# EAGLE design fan-shield (EAGLE 6.4)
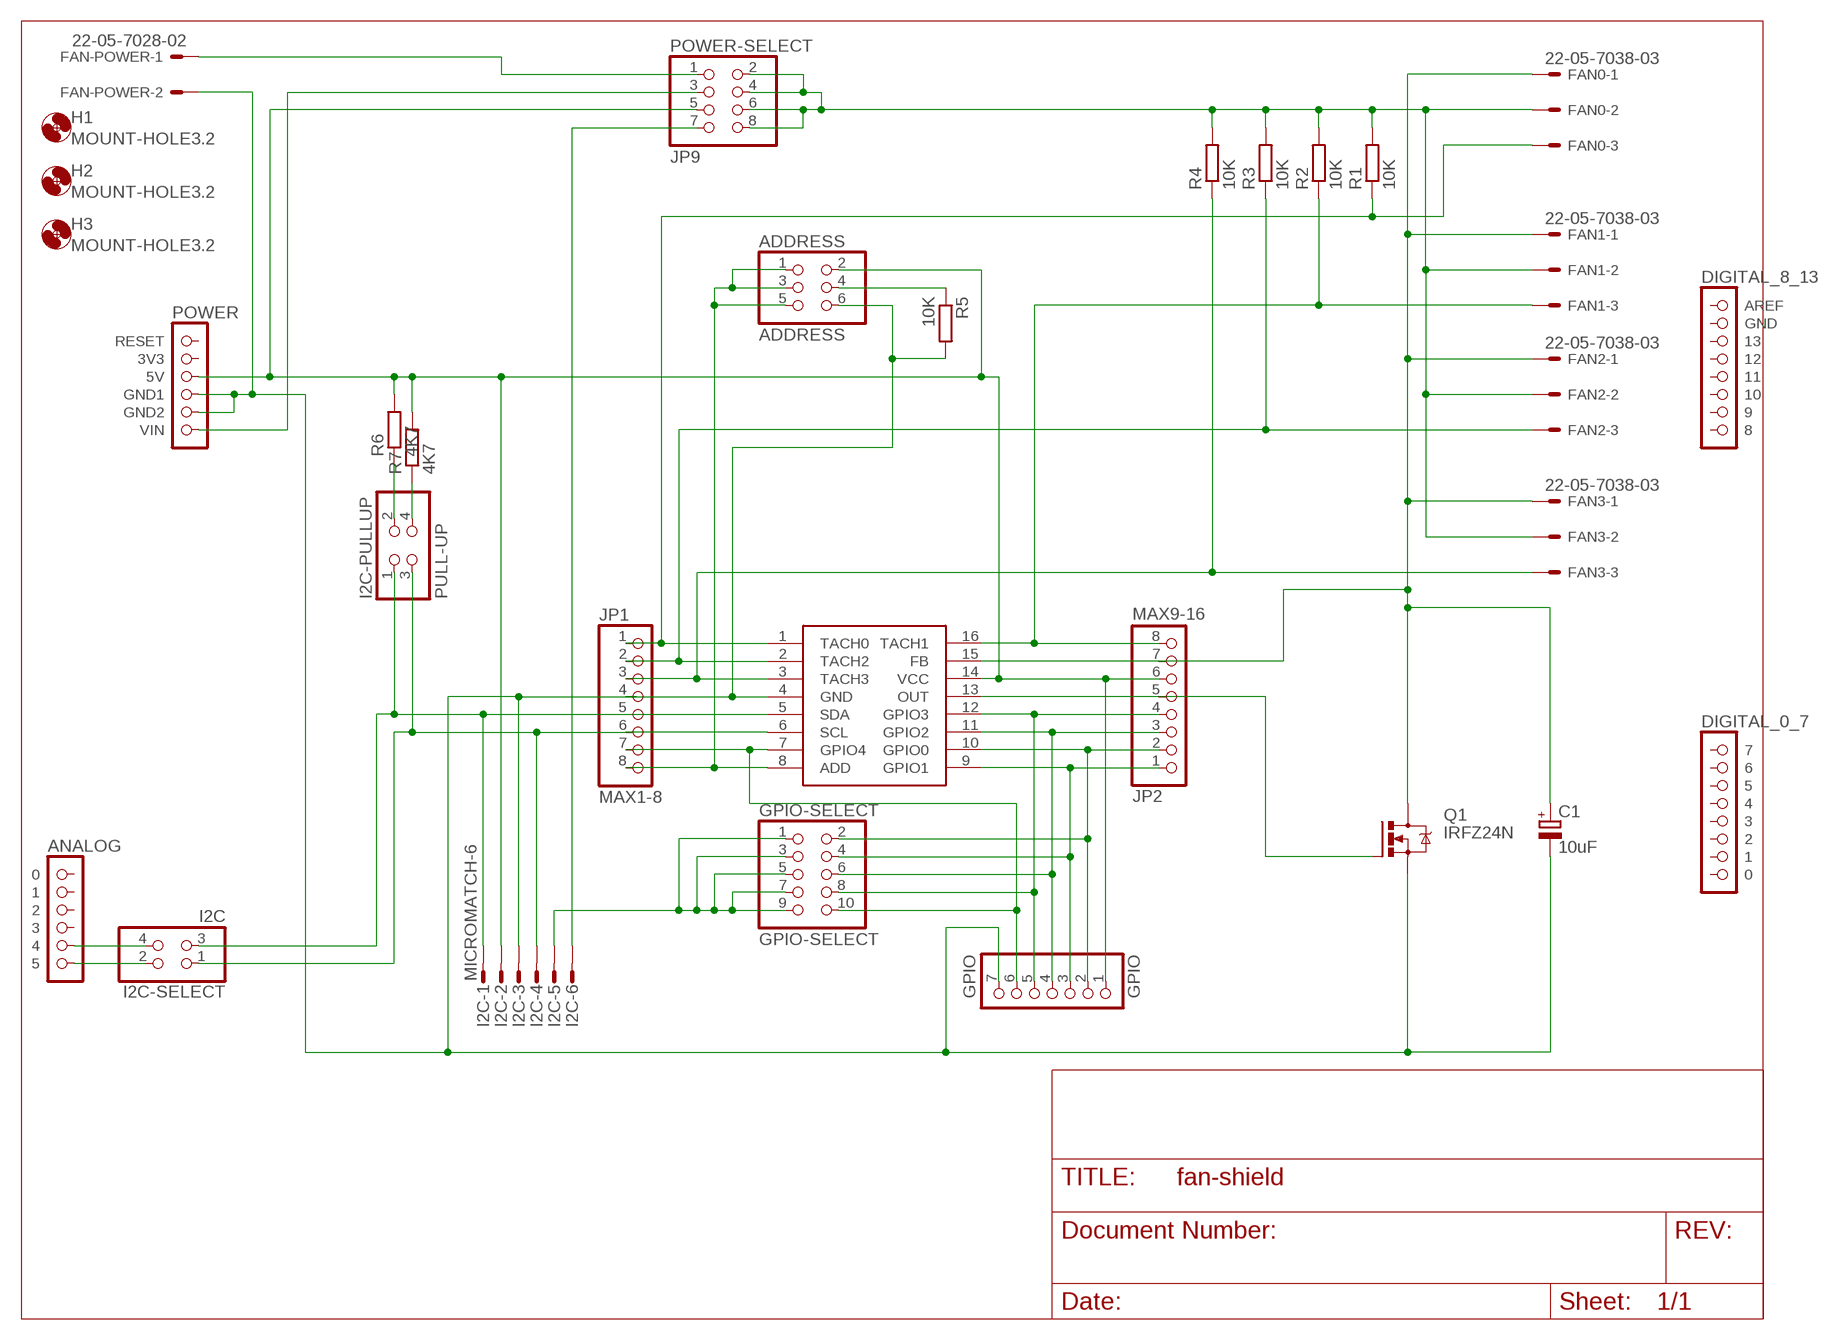
[diagram p0: schematic, sheet 1]

## Parts
ADDRESS  ADDRESS  PINHD-2X3  [2X03]
C1  10uF  CPOL-EUE2.5-6  [E2,5-6]
FAN0  22-05-7038-03  [7395-03]
FAN1  22-05-7038-03  [7395-03]
FAN2  22-05-7038-03  [7395-03]
FAN3  22-05-7038-03  [7395-03]
FAN-POWER  22-05-7028-02  [7395-02]
GPIO  GPIO  PINHD-1X7/90  [1X07/90]
GPIO-SELECT  GPIO-SELECT  PINHD-2X5  [2X05]
H1  MOUNT-HOLE3.2  [3,2]
H2  MOUNT-HOLE3.2  [3,2]
H3  MOUNT-HOLE3.2  [3,2]
I2C  MICROMATCH-6  [MICROMATCH-6]
I2C-PULLUP  PULL-UP  PINHD-2X2  [2X02]
I2C-SELECT  I2C  PINHD-2X2/90  [2X02/90]
JP1  MAX1-8  PINHD-1X8  [1X08]
JP2  MAX9-16  PINHD-1X8  [1X08]
MAX6651  MAX6651  [QSOP16]
POWER-SELECT  JP9  PINHD-2X4  [2X04]
Q1  IRFZ24N  [TO200AB]
R1  10K  R-EU_0207/10  [0207/10]
R2  10K  R-EU_0207/10  [0207/10]
R3  10K  R-EU_0207/10  [0207/10]
R4  10K  R-EU_0207/10  [0207/10]
R5  10K  R-EU_0207/10  [0207/10]
R6  4K7  R-EU_0207/10  [0207/10]
R7  4K7  R-EU_0207/10  [0207/10]
U$1  POWER  [1X06]
U$2  ANALOG  [1X06]
U$3  DIGITAL_0_7  [1X08]
U$4  DIGITAL_8_13  [1X08]

## Nets
5V: ADDRESS.2 GPIO.1 I2C.2 JP2.6 MAX6651.14(VCC) POWER-SELECT.5 R6.2 R7.2 U$1.3(5V)
ADD: ADDRESS.1 ADDRESS.3 ADDRESS.5 JP1.8 MAX6651.8(ADD)
FEEDBACK: C1.+ FAN0.1 FAN1.1 FAN2.1 FAN3.1 JP2.7 MAX6651.15(FB) Q1.D
GND: ADDRESS.6 C1.- FAN-POWER.2 GPIO.7 I2C.3 JP1.4 MAX6651.4(GND) Q1.S R5.2 U$1.4(GND1) U$1.5(GND2)
GPIO0: GPIO-SELECT.2 GPIO.2 JP2.2 MAX6651.10(GPIO0)
GPIO1: GPIO-SELECT.4 GPIO.3 JP2.1 MAX6651.9(GPIO1)
GPIO2: GPIO-SELECT.6 GPIO.4 JP2.3 MAX6651.11(GPIO2)
GPIO3: GPIO-SELECT.8 GPIO.5 JP2.4 MAX6651.12(GPIO3)
GPIO4: GPIO-SELECT.10 GPIO.6 JP1.7 MAX6651.7(GPIO4)
GPIO-CONNECT: GPIO-SELECT.1 GPIO-SELECT.3 GPIO-SELECT.5 GPIO-SELECT.7 GPIO-SELECT.9 I2C.5
I2C: I2C-SELECT.4 U$2.5
N$2: I2C-PULLUP.2 R6.1
N$3: I2C-PULLUP.4 R7.1
N$4: ADDRESS.4 R5.1
N$5: FAN-POWER.1 POWER-SELECT.1
OUT: JP2.5 MAX6651.13(OUT) Q1.G
SCL: I2C-PULLUP.3 I2C-SELECT.1 I2C.4 JP1.6 MAX6651.6(SCL)
SCL-ARDUINO: I2C-SELECT.2 U$2.6
SDA: I2C-PULLUP.1 I2C-SELECT.3 I2C.1 JP1.5 MAX6651.5(SDA)
TACH0: FAN0.3 JP1.1 MAX6651.1(TACH0) R1.1
TACH1: FAN1.3 JP2.8 MAX6651.16(TACH1) R2.1
TACH2: FAN2.3 JP1.2 MAX6651.2(TACH2) R3.1
TACH3: FAN3.3 JP1.3 MAX6651.3(TACH3) R4.1
VAUX: I2C.6 POWER-SELECT.7
VFAN: FAN0.2 FAN1.2 FAN2.2 FAN3.2 POWER-SELECT.2 POWER-SELECT.4 POWER-SELECT.6 POWER-SELECT.8 R1.2 R2.2 R3.2 R4.2
VIN: POWER-SELECT.3 U$1.6(VIN)
Unconnected: U$1.1(RESET) U$1.2(3V3) U$2.1 U$2.2 U$2.3 U$2.4 U$3.1 U$3.2 U$3.3 U$3.4 U$3.5 U$3.6 U$3.7 U$3.8 U$4.1(AREF) U$4.2(GND) U$4.3 U$4.4 U$4.5 U$4.6 U$4.7 U$4.8

## Library data of the parts
ADDRESS = pinhead:PINHD-2X3: PIN HEADER
C1 = resistor:CPOL-EU: POLARIZED CAPACITOR, European symbol
FAN0 FAN1-FAN3 = con-molex:22-?-03: CONNECTOR wire to board 2.54 mm (.1 inch) pitch header; OC_FARNELL: unknown; OC_NEWARK: unknown
FAN-POWER = con-molex:22-?-02: CONNECTOR wire to board 2.54 mm (.1 inch) pitch header; OC_FARNELL: 9731601; OC_NEWARK: unknown
GPIO = pinhead:PINHD-1X7: PIN HEADER
GPIO-SELECT = pinhead:PINHD-2X5: PIN HEADER
H1-H3 = holes:MOUNT-HOLE: MOUNTING HOLE with drill center marker
I2C = con-amp-micromatch:MICROMATCH-6: MicroMaTch 6 7-215464-6 / 0-215464-6 Drawing Number C-215464 DDEController.pdf; MPN: 7-215464-6; OC_FARNELL: 3784630; OC_NEWARK: 19R8125
I2C-PULLUP I2C-SELECT = pinhead:PINHD-2X2: PIN HEADER
JP1 JP2 = pinhead:PINHD-1X8: PIN HEADER
MAX6651 = rjs-maxim-fan-regulators:MAX6651
POWER-SELECT = pinhead:PINHD-2X4: PIN HEADER
Q1 = rjs-transistor-power:IRFZ24N: HEXFET power MOSFET
R1-R7 = resistor:R-EU_: RESISTOR, European symbol
U$1 = arduino:POWER
U$2 = arduino:ANALOG
U$3 = arduino:DIGITAL_0_7
U$4 = arduino:DIGITAL_8_13

## Board
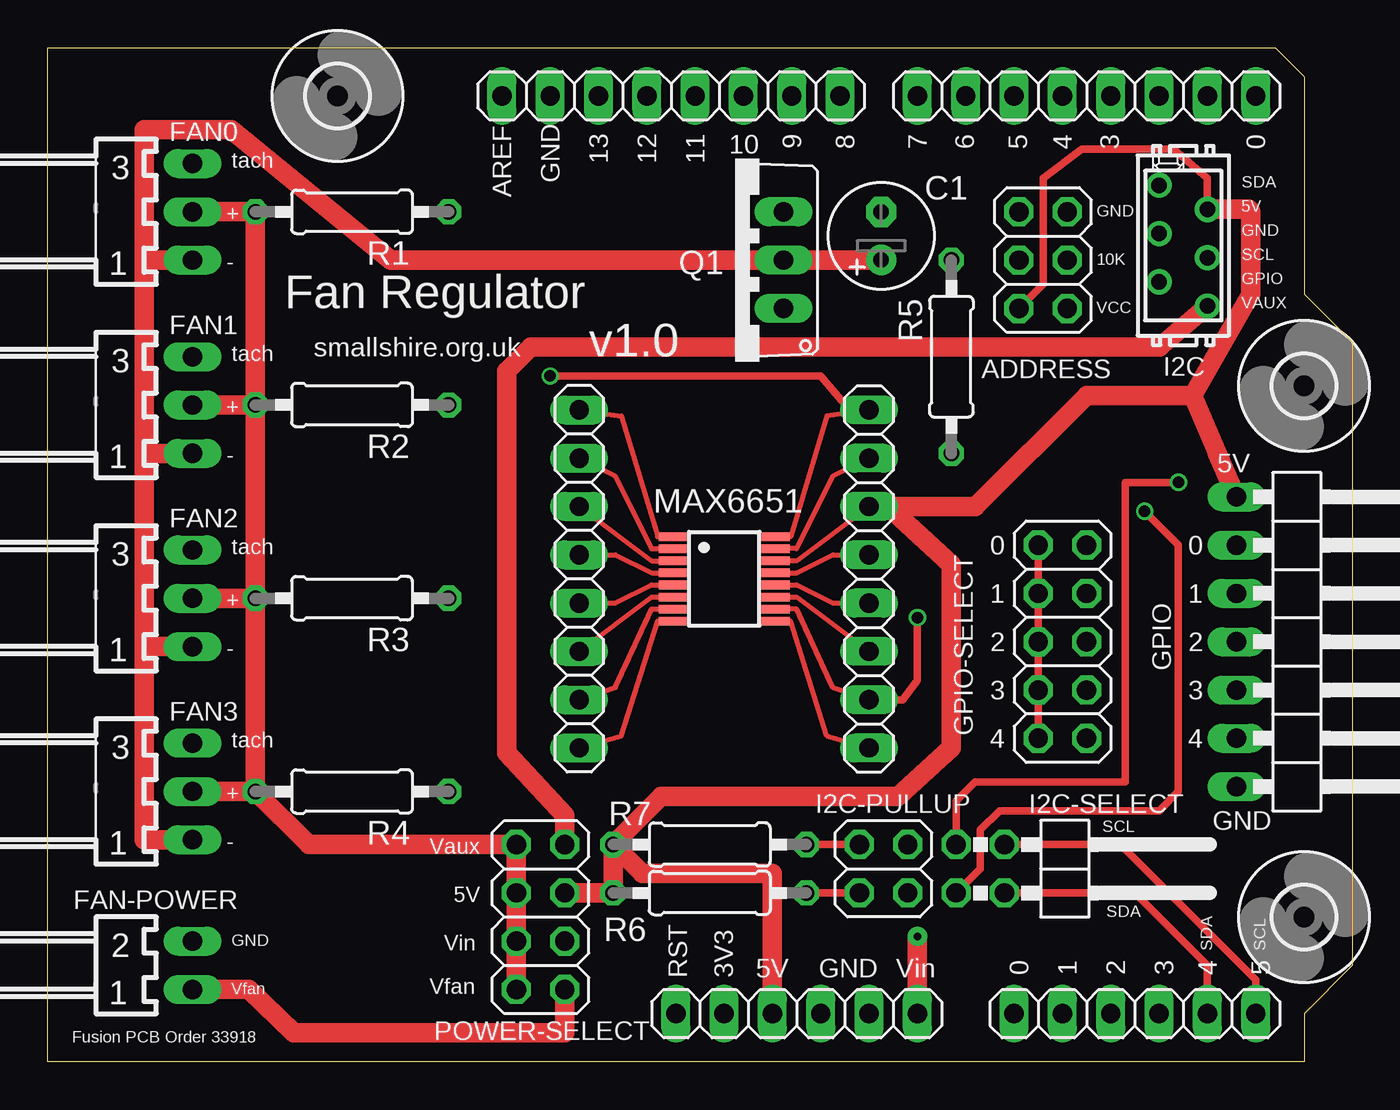
[diagram p1: board, top side]
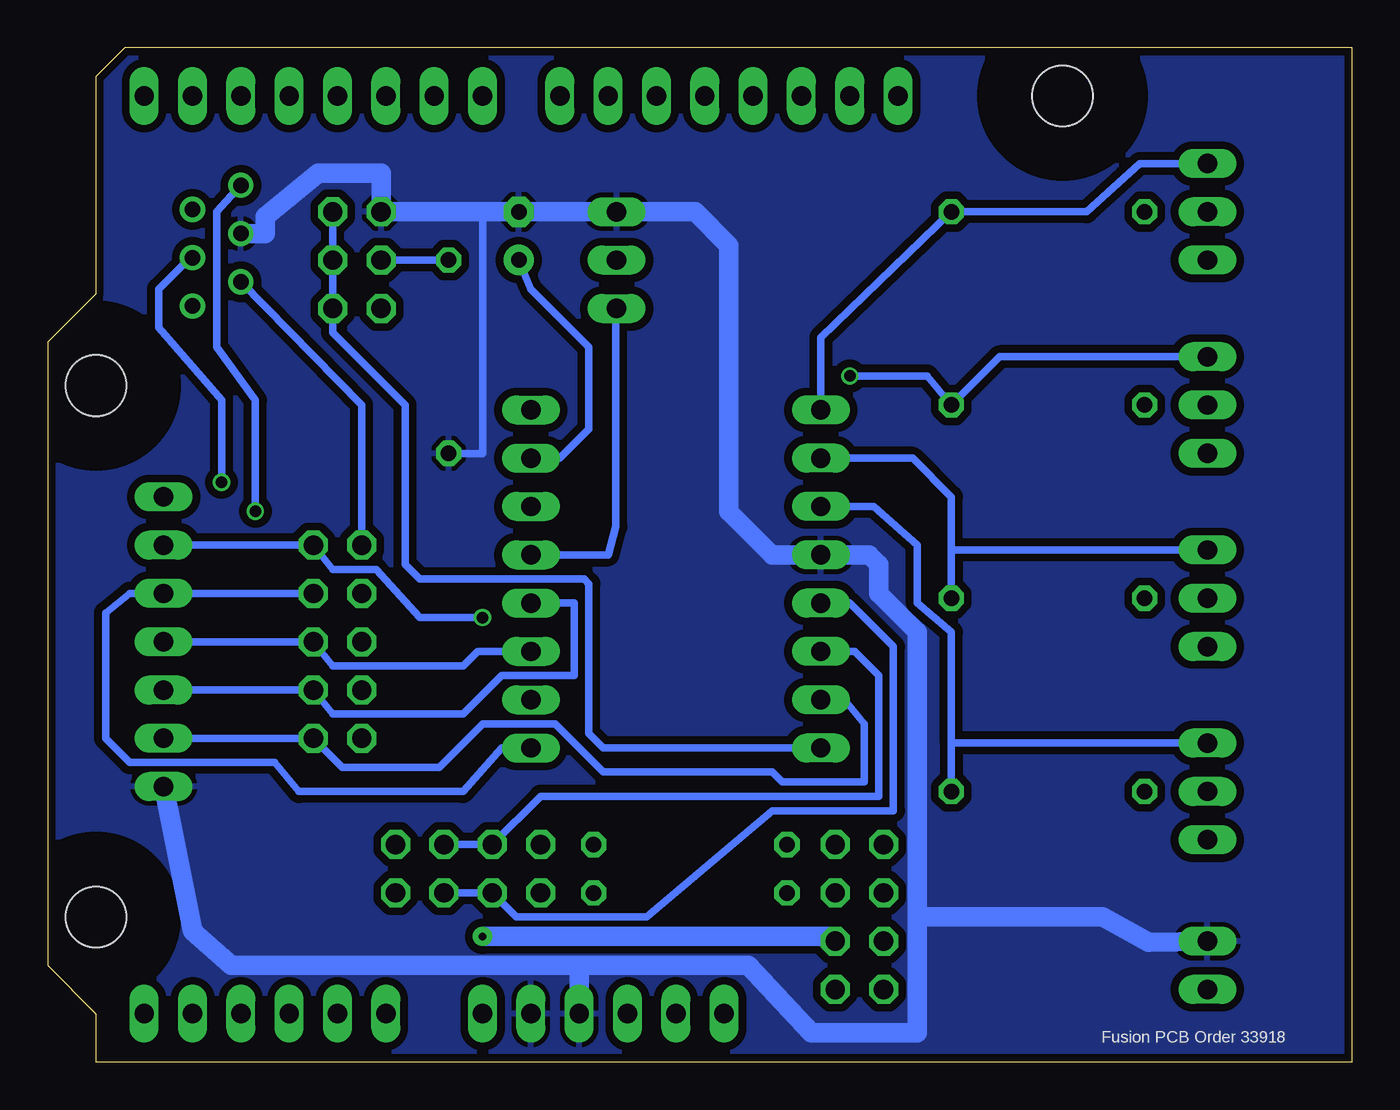
[diagram p2: board, bottom side, seen from below]

Size 68.58 x 53.34 mm. Coordinates in mm from the lower left corner, seen from the top.
Outline: 0,53.34 64.52,53.34 66.04,51.82 66.04,40.39 68.58,37.85 68.58,5.08 66.04,2.54 66.04,0 0,0 0,53.34
Copper layers (1*16): Top 0.035mm / dielectric 1.5mm / Bottom 0.035mm
Design rules "Fusion_eagle_rule_v1.1": minimum track width 6mil, minimum drill 12mil, track to track 6mil, track to pad 6mil, pad to pad 6mil, via to via 6mil, smd to smd 0mil, copper to edge 10mil, drill to drill 10mil, minimum pad ring 10mil, minimum via ring 6mil, stop-mask expansion 2mil, vias tented up to drill 100mil, thermal gap 10mil

### Footprints (pad centres in the part's own frame; a part is rotated, then mirrored left to right if it is on the bottom)
2X03 = drill 1.016 octagon: 1 -2.54,-1.27; 2 -2.54,1.27; 3 0,-1.27; 4 0,1.27; 5 2.54,-1.27; 6 2.54,1.27
E2,5-6 = drill 0.813 pad 1.6: + -1.27,0 | drill 0.813 pad 1.6 octagon: - 1.27,0
7395-03 = drill 1.016 long: 1 2.54,0; 2 0,0; 3 -2.54,0
7395-02 = drill 1.016 long: 1 1.27,0; 2 -1.27,0
1X07/90 = drill 1.016 long: 1 -7.62,-3.81; 2 -5.08,-3.81; 3 -2.54,-3.81; 4 0,-3.81; 5 2.54,-3.81; 6 5.08,-3.81; 7 7.62,-3.81
2X05 = drill 1.016 octagon: 1 -5.08,-1.27; 2 -5.08,1.27; 3 -2.54,-1.27; 4 -2.54,1.27; 5 0,-1.27; 6 0,1.27; 7 2.54,-1.27; 8 2.54,1.27; 9 5.08,-1.27; 10 5.08,1.27
3,2 = hole 3.2: 0,0
MICROMATCH-6 = drill 0.813: 1 3.175,1.27; 2 1.905,-1.27; 3 0.635,1.27; 4 -0.635,-1.27; 5 -1.905,1.27; 6 -3.175,-1.27
2X02 = drill 1.016 octagon: 1 -1.27,-1.27; 2 -1.27,1.27; 3 1.27,-1.27; 4 1.27,1.27
2X02/90 = drill 1.016 octagon: 1 -1.27,-6.35; 2 -1.27,-3.81; 3 1.27,-6.35; 4 1.27,-3.81
1X08 = drill 1.016 long: 1 -8.89,0; 2 -6.35,0; 3 -3.81,0; 4 -1.27,0; 5 1.27,0; 6 3.81,0; 7 6.35,0; 8 8.89,0
QSOP16 = smd 0.45 x 1.5: 1 -2.223,-2.69; 2 -1.587,-2.69; 3 -0.953,-2.69; 4 -0.318,-2.69; 5 0.318,-2.69; 6 0.953,-2.69; 7 1.587,-2.69; 8 2.223,-2.69; 9 2.223,2.69; 10 1.587,2.69; 11 0.953,2.69; 12 0.318,2.69; 13 -0.318,2.69; 14 -0.953,2.69; 15 -1.587,2.69; 16 -2.223,2.69
2X04 = drill 1.016 octagon: 1 -3.81,-1.27; 2 -3.81,1.27; 3 -1.27,-1.27; 4 -1.27,1.27; 5 1.27,-1.27; 6 1.27,1.27; 7 3.81,-1.27; 8 3.81,1.27
TO200AB = drill 1.016 long: D 0,-2.54; G -2.54,-2.54; S 2.54,-2.54
0207/10 = drill 0.813 octagon: 1 -5.08,0; 2 5.08,0
1X06 = drill 1.016 long: 1 -6.35,0; 2 -3.81,0; 3 -1.27,0; 4 1.27,0; 5 3.81,0; 6 6.35,0

### Placement (x,y rotation side)
ADDRESS  52.32,42.16 90 top
C1  43.81,43.43 90 top
FAN0  7.62,44.7 270 top
FAN1  7.62,34.54 270 top
FAN2  7.62,24.38 270 top
FAN3  7.62,14.22 270 top
FAN-POWER  7.62,5.08 270 top
GPIO  66.29,22.1 270 top
GPIO-SELECT  53.34,22.1 270 top
H1  15.24,50.8 0 top
H2  66.04,7.62 0 top
H3  66.04,35.56 0 top
I2C  59.69,42.93 90 top
I2C-PULLUP  43.94,10.16 90 top
I2C-SELECT  54.1,10.16 270 top
JP1  27.94,25.4 270 top
JP2  43.18,25.4 90 top
MAX6651  35.56,25.4 270 top
POWER-SELECT  25.91,7.62 90 top
Q1  36.13,42.16 90 top
R1  16,44.7 180 top
R2  16,34.54 180 top
R3  16,24.38 180 top
R4  16,14.22 180 top
R5  47.5,37.08 270 top
R6  34.8,8.89 180 top
R7  34.8,11.43 180 top
U$1  39.37,2.54 0 top
U$2  57.15,2.54 0 top
U$3  54.61,50.8 0 top
U$4  32.77,50.8 0 top

### Tracks (layer width: path | path; a pad name or v marks a point on that pad's centre or on a via)
5V
  Top 0.254: MAX6651.14 39.37,26.35 JP2.6
  Top 0.406: ADDRESS.2 52.32,40.89 52.32,46.48 54.36,48.01 59.18,48.01 60.96,46.48 I2C.2
  Top 1.016: POWER-SELECT.5 R6.2 R7.2 | R7.2 31.24,9.91 38.1,9.91 U$1.3 | 60.2,35.05 63.25,40.39 63.25,44.7 63.12,44.83 I2C.2 | 60.2,35.05 GPIO.1 61.47,32 | 44.2,29.21 JP2.6 | 44.2,29.21 47.5,26.16 47.5,16.51 44.7,13.97 32.26,13.97 R7.2 | 44.2,29.21 48.77,29.21 54.61,35.05 60.2,35.05
ADD
  Top 0.254: MAX6651.8 32.07,23.18 30.16,17.14 JP1.8
  Bottom 0.406: ADDRESS.5 ADDRESS.3 ADDRESS.1 53.59,38.35 49.78,34.54 49.78,26.16 49.02,25.4 40.39,25.4 40.13,25.15 40.13,17.27 39.37,16.51 JP1.8
FEEDBACK
  Top 0.254: MAX6651.15 39.37,26.99 41.27,30.8 JP2.7
  Top 1.016: C1.+ Q1.D 18.03,42.16 9.65,49.02 5.08,49.02 5.08,42.16 | FAN3.1 5.08,11.68 5.08,21.84 | 5.08,21.84 FAN2.1 | 5.08,32 FAN1.1 | 5.08,21.84 5.08,32 | 5.08,32 5.08,42.16 | 5.08,42.16 FAN0.1
  Bottom 0.406: C1.+ 43.18,40.64 40.13,37.59 40.13,33.27 41.66,31.75 JP2.7
GND
  Top 0.254: MAX6651.4 31.75,25.72 29.84,26.67 JP1.4
  Bottom 0.406: R5.2 45.72,32 45.72,44.7
  Bottom 1.016: 40.64,5.08 31.75,5.08 28.45,1.52 22.86,1.52 22.86,7.62 | 40.64,5.08 U$1.4 | GPIO.7 60.96,6.86 58.93,5.08 40.64,5.08 | 22.86,7.62 22.86,22.61 24.89,24.64 24.89,26.16 25.4,26.67 JP1.4 30.48,26.67 32.77,28.96 32.77,42.93 34.54,44.7 Q1.S C1.- 45.72,44.7 ADDRESS.6 51.05,46.74 54.36,46.74 57.15,44.45 57.15,43.56 I2C.3 | FAN-POWER.2 10.71,6.29 13.13,7.62 22.86,7.62
  pour Bottom (isolate 0.406): 0.25,53.09 64.26,53.09 64.77,52.58 65.79,51.56 65.79,40.13 68.33,37.59 68.33,5.33 65.53,2.54 65.53,0.51 0.25,0.25
GPIO0  (via drill 0.6)
  Top 0.254: MAX6651.10 39.37,23.81 41.27,19.68 JP2.2
  Top 0.406: JP2.2 44.96,19.05 45.72,20.07 v45.72,23.37
  Bottom 0.406: GPIO.2 GPIO-SELECT.2 53.59,25.91 51.31,25.91 49.02,23.37 v45.72,23.37
GPIO1
  Top 0.254: MAX6651.9 39.05,23.18 40.96,17.14 JP2.1
  Bottom 0.406: JP2.1 44.7,16.51 46.74,14.22 55.37,14.22 56.64,15.75 64.26,15.75 65.53,17.02 65.53,23.62 64.26,24.64 GPIO.3 GPIO-SELECT.4
GPIO2
  Top 0.254: MAX6651.11 39.37,24.45 JP2.3
  Bottom 0.406: JP2.3 45.97,21.59 46.74,20.83 53.59,20.83 GPIO-SELECT.6 GPIO.4
GPIO3
  Top 0.254: MAX6651.12 39.37,25.08 41.27,24.13 JP2.4
  Bottom 0.406: GPIO.5 GPIO-SELECT.8 53.59,18.29 46.74,18.29 44.7,20.32 40.89,20.32 40.89,24.13 JP2.4
GPIO4
  Top 0.254: MAX6651.7 31.75,23.81 29.84,19.68 JP1.7
  Bottom 0.406: GPIO.6 GPIO-SELECT.10 53.09,15.49 48.01,15.49 45.72,17.78 41.91,17.78 39.37,15.24 30.48,15.24 29.97,14.73 25.65,14.73 25.65,17.78 26.67,19.05 JP1.7
GPIO-CONNECT
  Top 0.406: GPIO-SELECT.9 GPIO-SELECT.7 GPIO-SELECT.5 GPIO-SELECT.3 GPIO-SELECT.1
  Bottom 0.406: GPIO-SELECT.1 52.07,34.54 I2C.5
I2C
  Top 0.406: U$2.5 60.96,5.08 57.15,8.89 I2C-SELECT.4
N$2
  Top 0.406: I2C-PULLUP.2 R6.1 39.37,8.89
N$3
  Top 0.406: I2C-PULLUP.4 R7.1 39.37,11.43
N$4
  Bottom 0.406: R5.1 ADDRESS.4
N$5
  Top 1.016: POWER-SELECT.1 27.18,1.52 12.94,1.52 10.56,3.81 FAN-POWER.1
OUT
  Top 0.254: MAX6651.13 39.37,25.72 41.27,26.67 JP2.5
  Bottom 0.406: Q1.G 38.71,39.06 38.71,28.14 39.12,26.67 JP2.5
SCL  (via drill 0.6)
  Top 0.254: MAX6651.6 31.75,24.45 JP1.6
  Top 0.406: v59.44,30.48 56.64,30.48 56.64,14.73 48.77,14.73 47.75,13.72 I2C-SELECT.1
  Bottom 0.406: JP1.6 26.16,21.59 24.89,20.32 24.89,13.97 42.67,13.97 I2C-PULLUP.3 I2C-SELECT.1 | I2C.4 61.21,42.16 62.74,40.64 62.74,38.61 59.44,34.8 v59.44,30.48
SCL-ARDUINO
  Top 0.406: I2C-SELECT.2 56.39,11.43 63.5,4.32 U$2.6
SDA  (via drill 0.6)
  Top 0.254: MAX6651.5 31.75,25.08 29.84,24.13 JP1.5
  Top 0.406: I2C-SELECT.3 49.02,10.16 49.02,12.19 50.04,13.21 58.42,13.21 59.44,14.22 59.44,27.18 v57.66,28.96
  Bottom 0.406: JP1.5 26.42,24.13 24.13,21.84 24.13,13.21 30.48,13.21 37.08,7.62 43.94,7.62 I2C-PULLUP.1 I2C-SELECT.3 | I2C.1 59.69,44.7 59.69,37.59 57.66,34.8 v57.66,28.96
TACH0
  Top 0.254: MAX6651.1 32.07,27.62 30.16,33.97 JP1.1
  Bottom 0.406: JP1.1 27.94,38.1 R1.1 13.97,44.7 11.18,47.24 FAN0.3
TACH1  (via drill 0.6)
  Top 0.254: MAX6651.16 39.05,27.62 40.96,33.97 JP2.8
  Top 0.406: v26.42,36.07 40.64,36.07 42.16,34.29 JP2.8
  Bottom 0.406: FAN1.3 18.54,37.08 R2.1 22.35,36.07 v26.42,36.07
TACH2
  Top 0.254: MAX6651.2 31.75,26.99 29.84,30.8 JP1.2
  Bottom 0.406: 21.08,26.92 21.08,29.72 23.11,31.75 JP1.2 | 21.08,26.92 R3.1 | FAN2.3 21.08,26.92
TACH3
  Top 0.254: MAX6651.3 31.75,26.35 JP1.3
  Bottom 0.406: JP1.3 25.15,29.21 22.86,27.18 22.86,24.13 21.08,22.61 21.08,16.76 | 21.08,16.76 R4.1 | FAN3.3 21.08,16.76
VAUX
  Top 1.016: POWER-SELECT.7 27.18,12.95 24.13,16.26 24.13,36.32 25.4,37.59 58.42,37.59 I2C.6
VFAN
  Top 1.016: R2.2 FAN1.2 | FAN0.2 R1.2 R2.2 | POWER-SELECT.2 POWER-SELECT.4 POWER-SELECT.6 POWER-SELECT.8 13.72,11.43 R4.2 | FAN3.2 R4.2 | R3.2 FAN2.2 | R4.2 R3.2 | R3.2 R2.2
VIN  (via drill 0.4 pad 1.02)
  Top 1.016: v45.72,6.6 U$1.6
  Bottom 1.016: POWER-SELECT.3 27.43,6.6 v45.72,6.6

### Text on the board
tPlace: 10 | tach | SDA | 5V | + | GND | GND | - | 10K | SCL | GPIO | VAUX | VCC | tach | + | - | 5V | tach | 0 | 0 | + | 1 | 1 | 2 | 2 | - | 3 | 3 | tach | 4 | 4 | + | SCL | GND | - | Vaux | 5V | SDA | GND | Vin | SDA | SCL | Vfan | Vfan | Fusion PCB Order 33918
bPlace: Fusion PCB Order 33918
tNames: 9 | 8 | 7 | 6 | 5 | 4 | 3 | 0 | 13 | 12 | 11 | GND | AREF | Fan Regulator | smallshire.org.uk | v1.0 | 0 | 1 | 2 | 3 | 4 | 5 | RST | 3V3 | 5V | GND | Vin
TallParts: USB | ISP | PWR